# EAGLE design main2 (EAGLE 7.5.0)
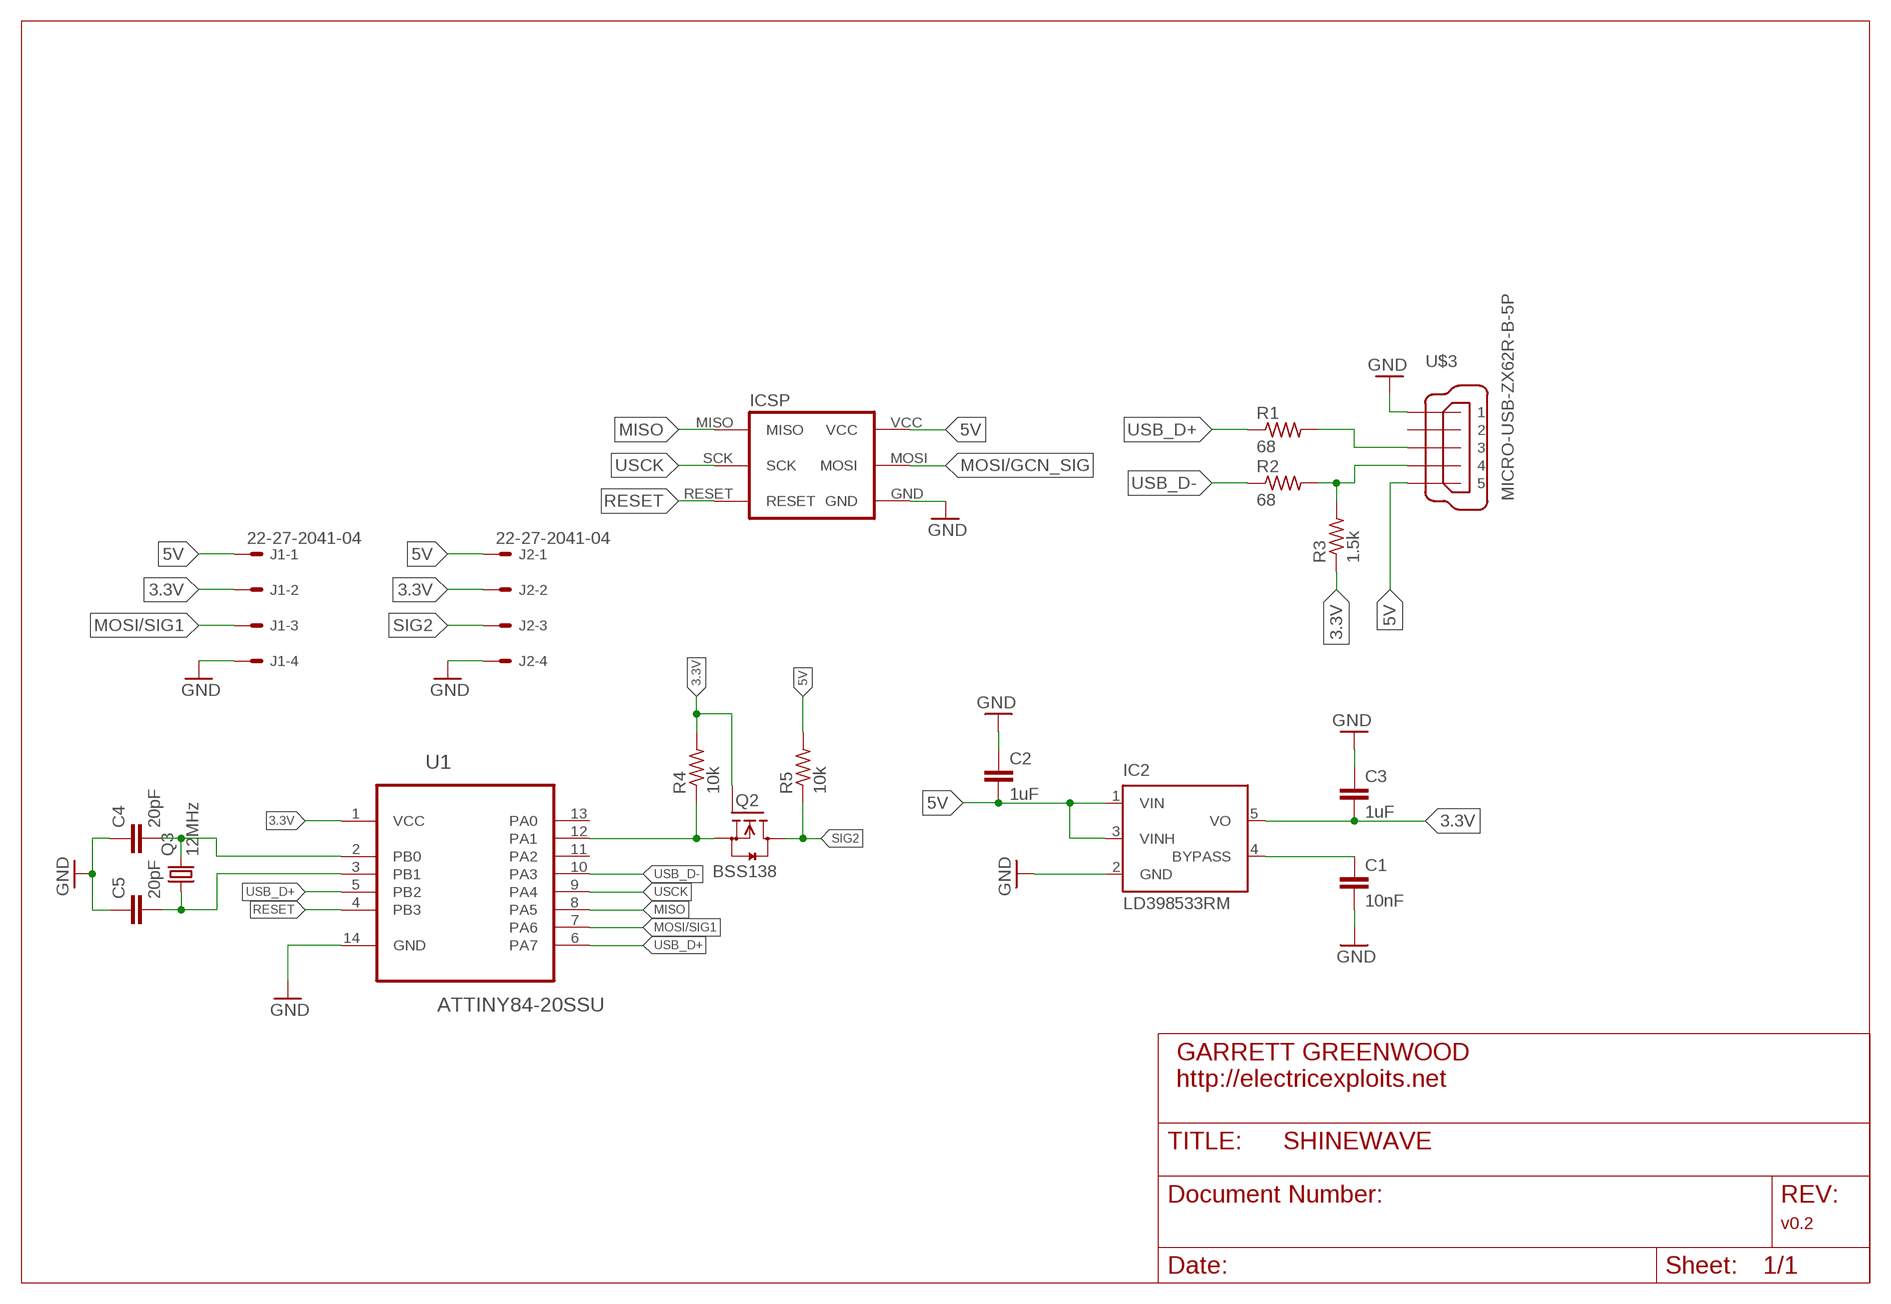
[diagram p0: schematic, sheet 1]

## Parts
C1  10nF  C-EUC0603  [C0603]
C2  1uF  C-EUC0603  [C0603]
C3  1uF  C-EUC0603  [C0603]
C4  20pF  C-EUC0603  [C0603]
C5  20pF  C-EUC0603  [C0603]
IC2  LD398533RM  [SOT23-5L]
J1  22-27-2041-04  [6410-04]
J2  22-27-2041-04  [6410-04]
Q2  BSS138  [SOT23]
Q3  12MHz  CRYSTALCTS406  [CTS406]
R1  68  R-US_R0603  [R0603]
R2  68  R-US_R0603  [R0603]
R3  1.5k  R-US_R0603  [R0603]
R4  10k  R-US_R0603  [R0603]
R5  10k  R-US_R0603  [R0603]
U1  ATTINY84-20SSU  [SOIC127P600X175-14N]
U$1  ICSP_POGO_INTERFACE  [ICSP_SMD]
U$3  MICRO-USB-ZX62R-B-5P  [ZX62R-B-5P]

## Nets
3.3V: C3.2 IC2.5(VO) J1.2 J2.2 Q2.1(G) R3.1 R4.2 U1.1(VCC)
5V: C2.2 IC2.1(VIN) IC2.3(VINH) J1.1 J2.1 R5.2 U$1.VCC U$3.5
GND: C1.2 C2.1 C3.1 C4.1 C5.1 IC2.2(GND) J1.4 J2.4 U1.14(GND) U$1.GND U$3.1
MISO: U1.8(PA5) U$1.MISO
MOSI/GCN_SIG: U$1.MOSI
MOSI/SIG1: J1.3 U1.7(PA6)
N$1: Q2.2(S) R4.1 U1.12(PA1)
N$4: C1.1 IC2.4(BYPASS)
N$5: R1.2 U$3.3
N$6: R2.2 R3.2 U$3.4
RESET: U1.4(PB3) U$1.RESET
SIG2: J2.3 Q2.3(D) R5.1
USB_D+: R1.1 U1.5(PB2) U1.6(PA7)
USB_D-: R2.1 U1.10(PA3)
USCK: U1.9(PA4) U$1.SCK
XTAL1: C4.2 Q3.3 U1.2(PB0)
XTAL2: C5.2 Q3.1 U1.3(PB1)
Unconnected: U1.11(PA2) U1.13(PA0) U$3.2

## Library data of the parts
C1-C5 = resistor:C-EU: CAPACITOR, European symbol
IC2 = st-microelectronics:LD3985: Ultra low drop and low noise BiCMOS voltage regulators Source: www.st.com LD3985.pdf
J1 J2 = con-molex:22-?-04: CONNECTOR wire to board 2.54 mm (.1 inch) pitch header; OC_FARNELL: unknown; OC_NEWARK: unknown
Q2 = m-pad-2.1:BSS138: Fairchild Semiconductors BSS138 N-Channel Logic Level Enhancement Mode Field Effect Transistor General Description: These N-Channel enhancement mode field effect transistors are produced using Fairchild's proprietary, high cell density, DMOS technology. These products have been designed to minimize on-state resistance while provide rugged, reliable, and fast switching performance.These products are particularly suited for low voltage, low current applications such as small servo motor control, power MOSFET gate drivers, and other switching applications. Features: 0.22 A, 50 V. RDS(ON) = 3.5Ohm @ VGS = 10 V RDS(ON) = 6.0Ohm @ VGS = 4.5 V High density cell design for extremely low RDS(ON) Rugged and Reliable Compact industry standard SOT-23 surface mount package Please send any comments to: messi@users.sourceforge.net
Q3 = crystal:CRYSTAL: CRYSTAL; OC_FARNELL: unknown; OC_NEWARK: unknown
R1-R5 = resistor:R-US_: RESISTOR, American symbol
U1 = Atmel_By_element14_Batch_1-00:ATTINY84-20SSU: 8-bit Microcontroller with Bytes In-System Programmable Flash; MPN: ATTINY84-20SSU; OC_FARNELL: 1636955; OC_NEWARK: 03P2040; PACKAGE: SOIC-14; SUPPLIER: Atmel
U$1 = shinewave:ICSP_POGO_INTERFACE: ICSP pads for programming over a pogo-pin interface.
U$3 = con-hirose:MICRO-USB-: Hirose Micro USB Connector ZX62R-B-5P: Micro B, reverse (top mount) shell SMT Supplier: DigiKey H11574CT-ND Source: http://www.hirose.co.jp/cataloge_hp/e24200011.pdf

## Board
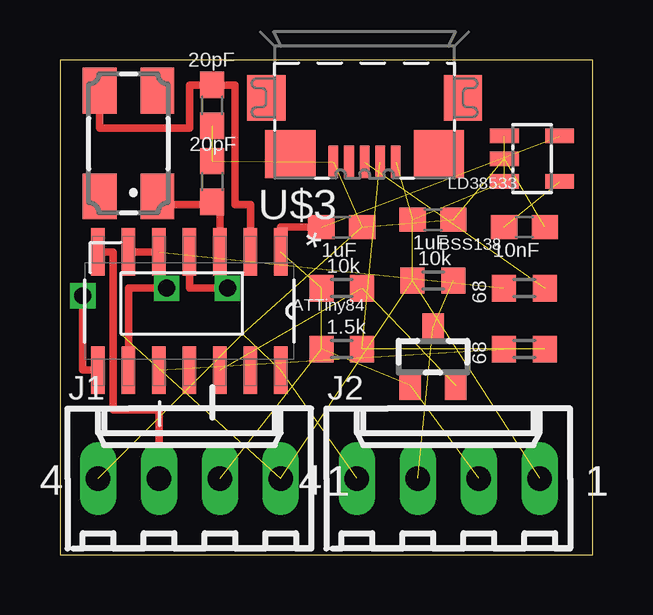
[diagram p1: board, top side]
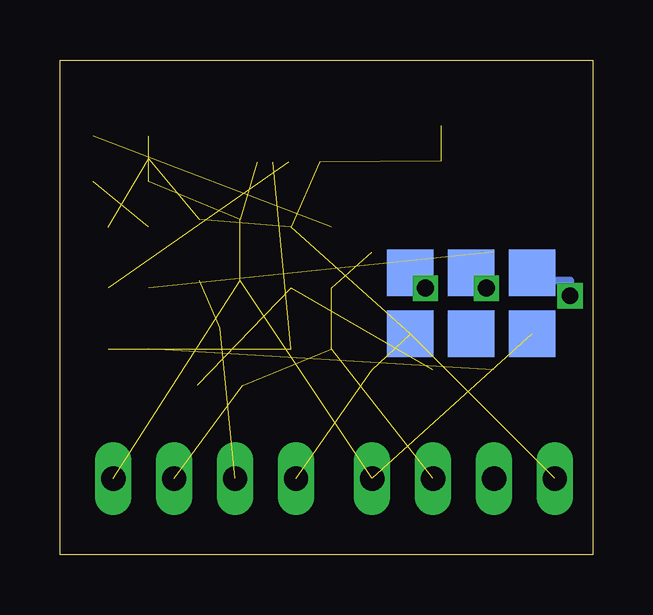
[diagram p2: board, bottom side, seen from below]

Size 22.23 x 20.63 mm. Coordinates in mm from the lower left corner, seen from the top.
Outline: 0,0 22.22,0 22.22,20.63 0,20.63 0,0
Copper layers (1*16): Top 0.0356mm / dielectric 1.5011mm / Bottom 0.0356mm
Design rules "LaenPCBOrder *": minimum track width 6mil, minimum drill 13mil, track to track 6mil, track to pad 6mil, pad to pad 6mil, via to via 6mil, smd to smd 6mil, copper to edge 8mil, drill to drill 6mil, minimum pad ring 7mil, minimum via ring 7mil, stop-mask expansion 3mil, vias tented up to drill 0mil, thermal gap 10mil

### Footprints (pad centres in the part's own frame; a part is rotated, then mirrored left to right if it is on the bottom)
C0603 = smd 1.1 x 1: 1 -0.85,0; 2 0.85,0
SOT23-5L = smd 0.6 x 1.2: 1 -0.95,-1.15; 2 0,-1.15; 3 0.95,-1.15; 4 0.95,1.15; 5 -0.95,1.15
6410-04 = drill 1.016 long: 1 3.81,0; 2 1.27,0; 3 -1.27,0; 4 -3.81,0
SOT23 = smd 0.9 x 1.2: 1 -0.95,-1.2; 2 0.95,-1.2; 3 0,1.2
CTS406 = smd 1.9 x 1.4: 1 -2.2,-1.2; 2 2.2,-1.2; 3 2.2,1.2; 4 -2.2,1.2
R0603 = smd 1 x 1.1: 1 -0.85,0; 2 0.85,0
SOIC127P600X175-14N = smd 1.981 x 0.559: 1 -2.464,3.81; 2 -2.464,2.54; 3 -2.464,1.27; 4 -2.464,0; 5 -2.464,-1.27; 6 -2.464,-2.54; 7 -2.464,-3.81; 8 2.464,-3.81; 9 2.464,-2.54; 10 2.464,-1.27; 11 2.464,0; 12 2.464,1.27; 13 2.464,2.54; 14 2.464,3.81
ICSP_SMD = smd 1.93 x 1.93 bottom: GND 0,0; MISO 2.54,5.08; MOSI 0,2.54; RESET 2.54,0; SCK 2.54,2.54; VCC 0,5.08
ZX62R-B-5P = smd 1.35 x 0.4: 1 2.675,-1.3; 2 2.675,-0.65; 3 2.675,0; 4 2.675,0.65; 5 2.675,1.3 | smd 1.9 x 1.6: M1 0,-4.1; M2 0,4.1 | smd 2 x 2.1: M3 2.35,3.1; M4 2.35,-3.1

### Placement (x,y rotation side)
C1  19.37,13.65 0 top
C2  15.56,13.97 180 top
C3  11.75,13.65 180 top
C4  6.35,18.73 90 top
C5  6.35,15.56 270 top
IC2  19.69,16.51 270 top
J1  5.4,3.18 0 top
J2  16.19,3.18 0 top
Q2  15.56,8.26 0 top
Q3  2.86,17.14 90 top
R1  19.37,11.11 0 top
R2  19.37,8.57 0 top
R3  11.75,8.57 0 top
R4  11.75,11.11 180 top
R5  15.56,11.43 180 top
U1  5.4,10.16 270 top
U$1  7.62,9.21 90 top
U$3  12.7,19.05 270 top

### Tracks (layer width: path | path; a pad name or v marks a point on that pad's centre or on a via)
3.3V  (6 unrouted)
  Top 0.305: C3.2 9.21,13.65 U1.1
5V  (7 unrouted)
GND  (10 unrouted)
MISO  (via drill 0.7)
  Top 0.305: U1.8 0.95,7.7 v0.95,10.79
  Bottom 0.305: v0.95,10.79 0.95,11.43 2.54,11.43 U$1.MISO
MOSI/SIG1
  Top 0.305: U1.7 2.22,12.62 2.22,6.03 4.13,6.03 J1.3
N$1  (2 unrouted)
N$4  (1 unrouted)
N$5  (1 unrouted)
N$6  (2 unrouted)
RESET  (via drill 0.7)
  Top 0.305: v6.98,11.11 5.4,11.11 U1.4
  Bottom 0.305: U$1.RESET 6.98,11.75 v6.98,11.11
SIG2  (2 unrouted)
USB_D+  (1 unrouted)
  Top 0.305: U1.6 U1.5
USB_D-  (1 unrouted)
USCK  (via drill 0.7)
  Top 0.305: v4.44,11.11 2.86,11.11 U1.9
  Bottom 0.305: U$1.SCK 4.44,11.75 v4.44,11.11
XTAL1
  Top 0.305: Q3.3 1.66,17.78 5.4,17.78 5.4,19.58 C4.2 7.3,19.58 7.3,14.61 7.94,14.61 U1.2
XTAL2
  Top 0.305: Q3.1 4.44,14.95 4.44,14.61 6.35,14.61 C5.2 6.67,14.71 U1.3

### Text on the board
tNames: LD38533 | BSS138 | ATTiny84